# Altium schematic sheet 5R_Supply.SchDoc
size Tabloid
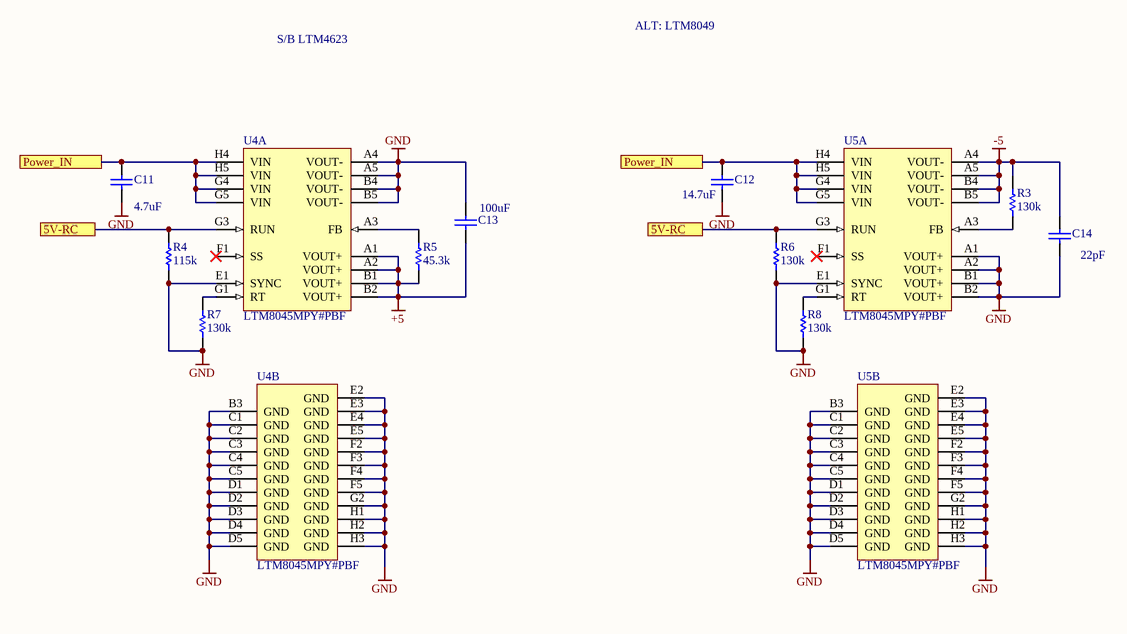
[diagram p0: 5R_Supply.SchDoc]

## Parts
C11  value 4.7uF  [CAPC1206(3216)110_N]
C12  Capacitance: 14.7uF  [CAPC1206(3216)130_N]  (hidden comment: CAP CER 10UF 6.3V X5R 1206)
C13  value 100uF  [CAPC1210(3225)100_N]
C14  Capacitance: 22pF  [CAPC1206(3216)130_N]  (hidden comment: CAP CER 10UF 6.3V X5R 1206)
R3  Resistance (Ohms): 130k  [RESC0805(2012)_M]  (hidden comment: RES SMD 43K OHM 1% 1/8W 0805)
R4  Resistance (Ohms): 115k  [RESC0805(2012)_M]  (hidden comment: RES SMD 43K OHM 1% 1/8W 0805)
R5  Resistance (Ohms): 45.3k  [RESC0805(2012)_M]
R6  Resistance (Ohms): 130k  [RESC0805(2012)_M]  (hidden comment: RES SMD 43K OHM 1% 1/8W 0805)
R7  Resistance (Ohms): 130k  [RESC0805(2012)_M]  (hidden comment: RES SMD 43K OHM 1% 1/8W 0805)
R8  Resistance (Ohms): 130k  [RESC0805(2012)_M]  (hidden comment: RES SMD 43K OHM 1% 1/8W 0805)
U4  LTM8045MPY#PBF  [LT-BGA-40-11250X6250X4920]  (parts A,B of 2)
U5  LTM8045MPY#PBF  [LT-BGA-40-11250X6250X4920]  (parts A,B of 2)

## Ports
5V-RC, Power_IN

## Nets
+5: C13.1 R5.1 U4.A1(VOUT+) U4.A2(VOUT+) U4.B1(VOUT+) U4.B2(VOUT+)
-5: C14.2 R3.2 U5.A4(VOUT-) U5.A5(VOUT-) U5.B4(VOUT-) U5.B5(VOUT-)
GND: C11.1 C12.1 C13.2 C14.1 R4.1 R6.1 R7.1 R8.1 U4.A4(VOUT-) U4.A5(VOUT-) U4.B3(GND) U4.B4(VOUT-) U4.B5(VOUT-) U4.C1(GND) U4.C2(GND) U4.C3(GND) U4.C4(GND) U4.C5(GND) U4.D1(GND) U4.D2(GND) U4.D3(GND) U4.D4(GND) U4.D5(GND) U4.E1(SYNC) U4.E2(GND) U4.E3(GND) U4.E4(GND) U4.E5(GND) U4.F2(GND) U4.F3(GND) U4.F4(GND) U4.F5(GND) U4.G2(GND) U4.H1(GND) U4.H2(GND) U4.H3(GND) U5.A1(VOUT+) U5.A2(VOUT+) U5.B1(VOUT+) U5.B2(VOUT+) U5.B3(GND) U5.C1(GND) U5.C2(GND) U5.C3(GND) U5.C4(GND) U5.C5(GND) U5.D1(GND) U5.D2(GND) U5.D3(GND) U5.D4(GND) U5.D5(GND) U5.E1(SYNC) U5.E2(GND) U5.E3(GND) U5.E4(GND) U5.E5(GND) U5.F2(GND) U5.F3(GND) U5.F4(GND) U5.F5(GND) U5.G2(GND) U5.H1(GND) U5.H2(GND) U5.H3(GND)
5V-RC: R4.2 R6.2 U4.G3(RUN) U5.G3(RUN) ; port 5V-RC
Power_IN: C11.2 C12.2 U4.G4(VIN) U4.G5(VIN) U4.H4(VIN) U4.H5(VIN) U5.G4(VIN) U5.G5(VIN) U5.H4(VIN) U5.H5(VIN) ; port Power_IN
NetR3_1: R3.1 U5.A3(FB)
NetR5_2: R5.2 U4.A3(FB)
NetR7_2: R7.2 U4.G1(RT)
NetR8_2: R8.2 U5.G1(RT)

Not connected (* = marked no-connect by the designer): U4 F1(SS)*; U5 F1(SS)*

## Notes on the sheet
- S/B LTM4623
- ALT: LTM8049
- Title
- Size:
- Date:
- Tabloid
- Number:
- Time:
- Revision:
- Sheet
- of
- ZLS Corporation
- 7801 North Lamar Blvd.
- Suite E-184
- Austin, Texas 78752  USA
- (512) 453-0288
- File:

## Library data of the parts
C11 = CMP-1037-04332-1
C12 C14 = CMP-1037-04913-1: Manufacturer: Taiyo Yuden; Manufacturer Part Number: JMK316BJ106ML-T; Tolerance: ±20%; Notification: Current market demand for these product types have resulted in fluctuating and extending lead times. Lead times may differ.; Supplier 1: Digi-Key; Supplier Part Number 1: 587-5447-1-ND; RoHS: RoHS Compliant; Category: Capacitors; Stock 1: 5600; Pricing 1: 1=0.24, 10=0.161, 100=0.0817, 500=0.05592, 1000=0.04946 (USD); Packaging: Cut Tape (CT); Part Status: Active; Voltage - Rated: 6.3V; Temperature Coefficient: X5R; Operating Temperature: -55°C ~ 85°C; Features: -; Ratings: -; Applications: SMPS Filtering; Failure Rate: -; Mounting Type: Surface Mount, MLCC; Package / Case: 1206 (3216 Metric); Size / Dimension: 0.126" L x 0.063" W (3.20mm x 1.60mm); Height - Seated (Max): -; Thickness (Max): 0.071" (1.80mm); Lead Spacing: -; Lead Style: -; ComponentLink1URL: http://ds.yuden.co.jp/TYCOMPAS/ut/detail.do?productNo=JMK316BJ106ML-T&fileName=JMK316BJ106ML-T_SS&mode=specSheetDownload; ComponentLink1Description: http://ds.yuden.co.jp/TYCOMPAS/ut/detail.do?productNo=JMK316BJ106ML-T&fileName=JMK316BJ106ML-T_SS&mode=specSheetDownload
C13 = CMP-1038-01331-1
R3 R4 R6-R8 = CMP-1013-00017-1: RES SMD 10K OHM 1% 1/8W 0805
R5 = CMP-1013-00017-1
U4 U5 = CMP-0483-00032-1: Inverting or SEPIC uModule DC/DC Converter with Up to 700 mA Output Current, 40-pin BGA, -55 to 125 degC, Pb-Free, Tray; Manufacturer: Linear Technology; Synchronous: no; Isupply(mA): 10; Frequency Sync Range: 200kHz - 2MHz; Number of Outputs: 1; Vin Min(V): 2.8; Switch Current(A): 3; Vin Max(V): 18; Topology: Sepic, Inverting; Extended Temp: E, I, MP; Frequency(kHz): 2000; PackageDescription: 40-Ball BGA, Body 11.25 x 6.25 mm, Pitch 1.27 mm; PartNumber: LTM8045MPY#PBF; Ishutdown(uA): 1; Frequency Adjust Range: 200kHz - 2MHz; PackageReference: BGA-40; Packing: Tray; DatasheetVersion: Rev. A; Vout Max(V): 18; ComponentLink1URL: http://www.linear.com/; Code_JEDEC: MS-028; Vswitch Max(V): 18; Tracking: no; RoHS: TRUE; Mounting Technology: Surface Mount; ComponentLink3Description: Package Specification; ComponentLink3URL: http://cds.linear.com/docs/en/packaging/BGA_40_05-08-1867.pdf; ComponentLink2Description: Datasheet; PackageVersion: Rev. Ã˜, 08/2010; ComponentLink1Description: Manufacturer URL; ComponentLink2URL: http://cds.linear.com/docs/en/datasheet/8045fa.pdf; PartId: 1